# EAGLE design 5-Band 50W PA_LC Lowpass Filters (EAGLE 9.4.2)
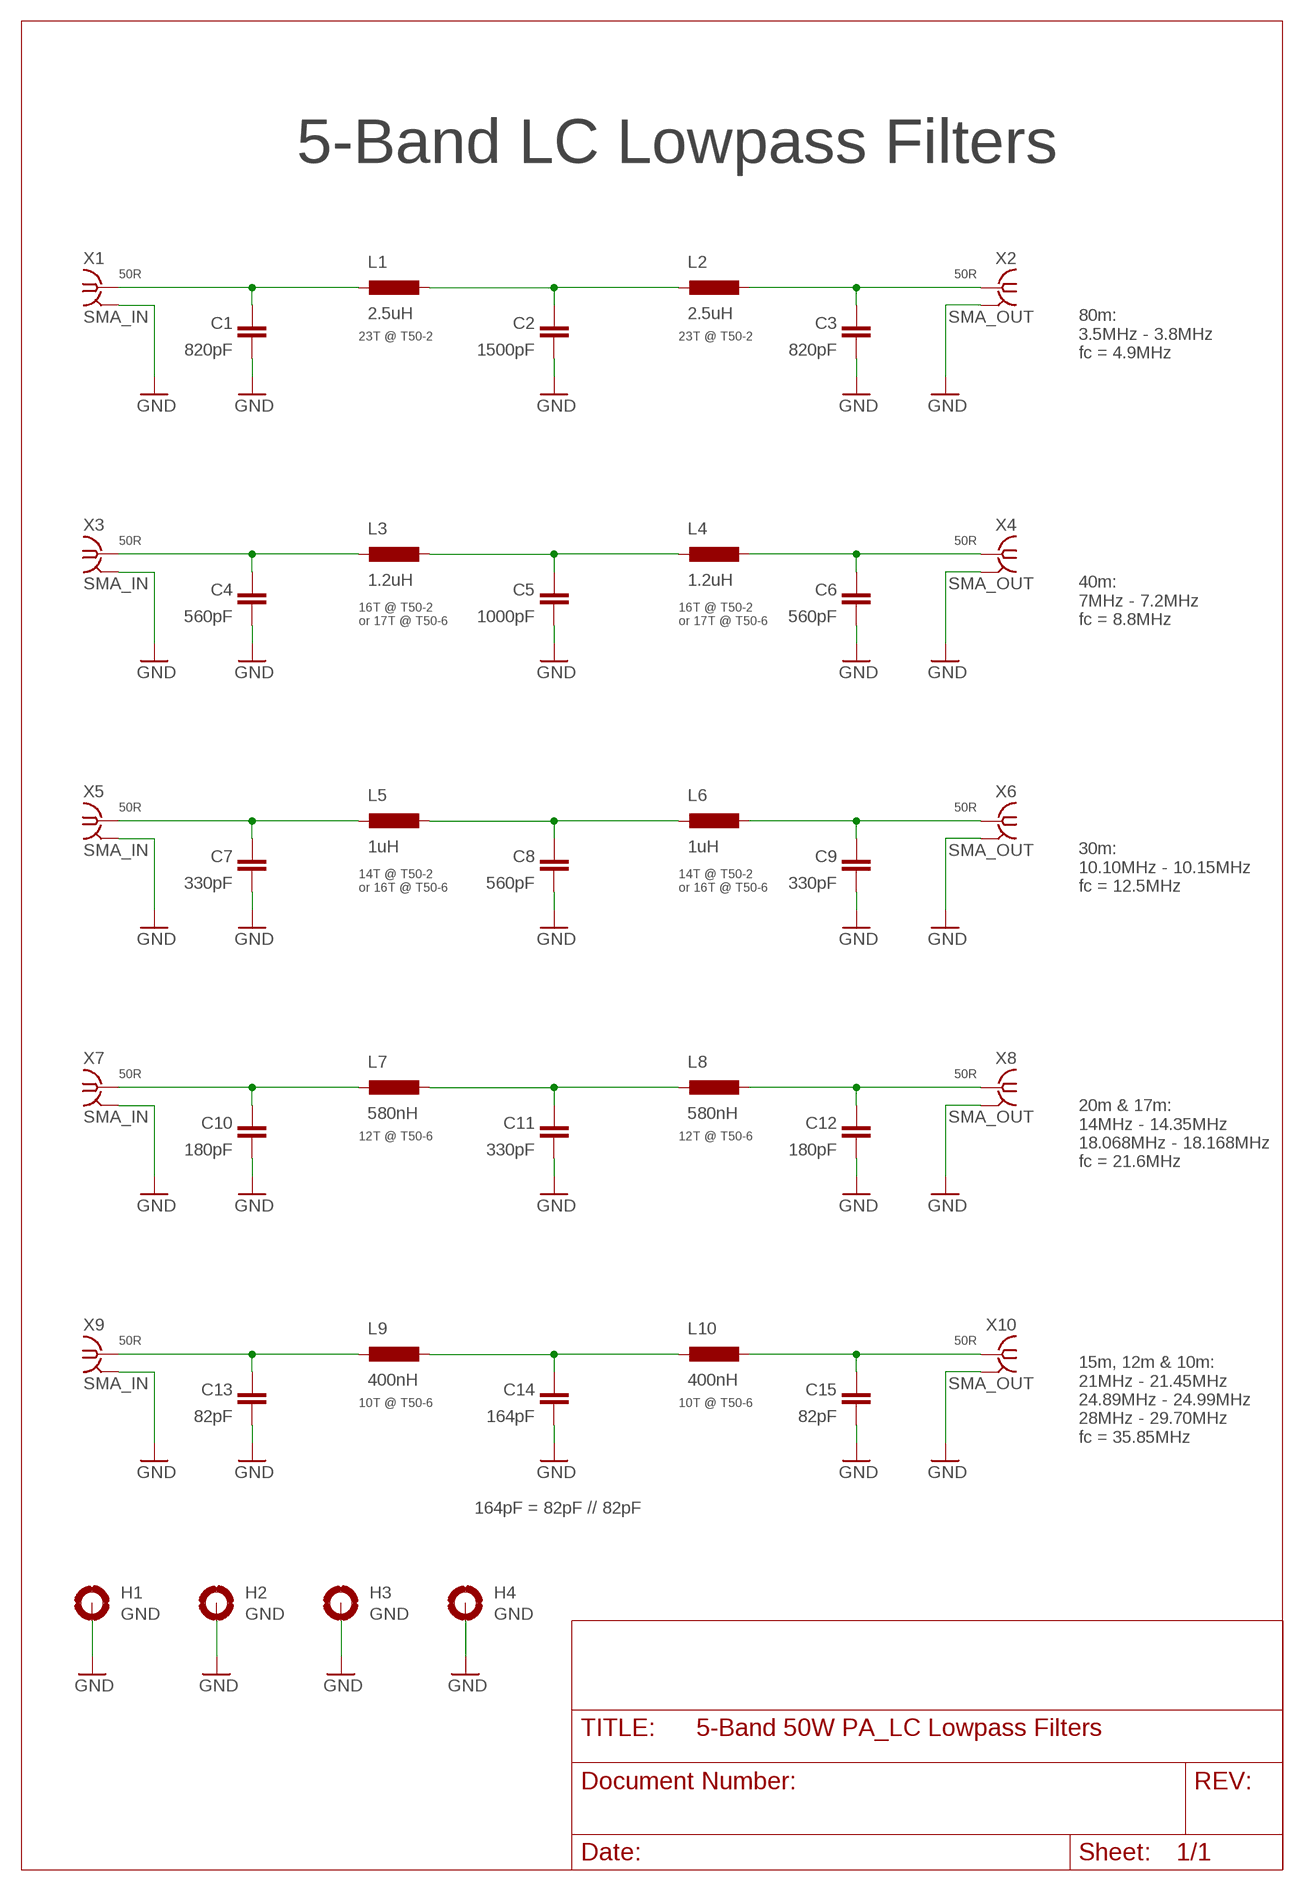
[diagram p0: schematic, sheet 1]

## Parts
C1  820pF  C-EUC1206K  [C1206K]
C2  1500pF  C-EUC1206K  [C1206K]
C3  820pF  C-EUC1206K  [C1206K]
C4  560pF  C-EUC1206K  [C1206K]
C5  1000pF  C-EUC1206K  [C1206K]
C6  560pF  C-EUC1206K  [C1206K]
C7  330pF  C-EUC1206K  [C1206K]
C8  560pF  C-EUC1206K  [C1206K]
C9  330pF  C-EUC1206K  [C1206K]
C10  180pF  C-EUC1206K  [C1206K]
C11  330pF  C-EUC1206K  [C1206K]
C12  180pF  C-EUC1206K  [C1206K]
C13  82pF  C-EUC1206K  [C1206K]
C14  164pF  C-EUC1206K  [C1206K]
C15  82pF  C-EUC1206K  [C1206K]
H1  GND  MOUNT-PAD-ROUND3.0  [3,0-PAD]
H2  GND  MOUNT-PAD-ROUND3.0  [3,0-PAD]
H3  GND  MOUNT-PAD-ROUND3.0  [3,0-PAD]
H4  GND  MOUNT-PAD-ROUND3.0  [3,0-PAD]
L1  2.5uH  T50-6  [T50-6SMD]
L2  2.5uH  T50-6  [T50-6SMD]
L3  1.2uH  T50-6  [T50-6SMD]
L4  1.2uH  T50-6  [T50-6SMD]
L5  1uH  T50-6  [T50-6SMD]
L6  1uH  T50-6  [T50-6SMD]
L7  580nH  T50-6  [T50-6SMD]
L8  580nH  T50-6  [T50-6SMD]
L9  400nH  T50-6  [T50-6SMD]
L10  400nH  T50-6  [T50-6SMD]
X1  SMA_IN  SMA-142-0711-821/826  [J502-ND-142-0711-821/826]
X2  SMA_OUT  SMA-142-0711-821/826  [J502-ND-142-0711-821/826]
X3  SMA_IN  SMA-142-0711-821/826  [J502-ND-142-0711-821/826]
X4  SMA_OUT  SMA-142-0711-821/826  [J502-ND-142-0711-821/826]
X5  SMA_IN  SMA-142-0711-821/826  [J502-ND-142-0711-821/826]
X6  SMA_OUT  SMA-142-0711-821/826  [J502-ND-142-0711-821/826]
X7  SMA_IN  SMA-142-0711-821/826  [J502-ND-142-0711-821/826]
X8  SMA_OUT  SMA-142-0711-821/826  [J502-ND-142-0711-821/826]
X9  SMA_IN  SMA-142-0711-821/826  [J502-ND-142-0711-821/826]
X10  SMA_OUT  SMA-142-0711-821/826  [J502-ND-142-0711-821/826]

## Nets
GND: C1.1 C2.1 C3.1 C4.1 C5.1 C6.1 C7.1 C8.1 C9.1 C10.1 C11.1 C12.1 C13.1 C14.1 C15.1 H1.B3,0(MOUNT) H2.B3,0(MOUNT) H3.B3,0(MOUNT) H4.B3,0(MOUNT) X1.G@1 X1.G@2 X1.G@3 X1.G@4 X2.G@1 X2.G@2 X2.G@3 X2.G@4 X3.G@1 X3.G@2 X3.G@3 X3.G@4 X4.G@1 X4.G@2 X4.G@3 X4.G@4 X5.G@1 X5.G@2 X5.G@3 X5.G@4 X6.G@1 X6.G@2 X6.G@3 X6.G@4 X7.G@1 X7.G@2 X7.G@3 X7.G@4 X8.G@1 X8.G@2 X8.G@3 X8.G@4 X9.G@1 X9.G@2 X9.G@3 X9.G@4 X10.G@1 X10.G@2 X10.G@3 X10.G@4
N$1: C2.2 L1.P$2 L2.P$1
N$2: C4.2 L3.P$1 X3.1
N$3: C3.2 L2.P$2 X2.1
N$4: C1.2 L1.P$1 X1.1
N$5: C6.2 L4.P$2 X4.1
N$6: C5.2 L3.P$2 L4.P$1
N$7: C7.2 L5.P$1 X5.1
N$8: C9.2 L6.P$2 X6.1
N$9: C8.2 L5.P$2 L6.P$1
N$10: C10.2 L7.P$1 X7.1
N$11: C12.2 L8.P$2 X8.1
N$12: C11.2 L7.P$2 L8.P$1
N$13: C13.2 L9.P$1 X9.1
N$14: C15.2 L10.P$2 X10.1
N$15: C14.2 L9.P$2 L10.P$1

## Notes on the sheet
- 5-Band LC Lowpass Filters
- 50R | 50R
- 23T @ T50-2 | 23T @ T50-2
- 80m:
  3.5MHz - 3.8MHz
  fc = 4.9MHz
- 50R | 50R
- 16T @ T50-2 
  or 17T @ T50-6
- 16T @ T50-2 
  or 17T @ T50-6
- 40m:
  7MHz - 7.2MHz
  fc = 8.8MHz
- 50R | 50R
- 14T @ T50-2
  or 16T @ T50-6
- 14T @ T50-2
  or 16T @ T50-6
- 30m:
  10.10MHz - 10.15MHz
  fc = 12.5MHz
- 50R | 50R
- 12T @ T50-6 | 12T @ T50-6
- 20m & 17m:
  14MHz - 14.35MHz
  18.068MHz - 18.168MHz
  fc = 21.6MHz
- 50R | 50R
- 10T @ T50-6 | 10T @ T50-6
- 15m, 12m & 10m:
  21MHz - 21.45MHz
  24.89MHz - 24.99MHz
  28MHz - 29.70MHz
  fc = 35.85MHz
- 164pF = 82pF // 82pF

## Library data of the parts
C1-C15 = rcl:C-EU: CAPACITOR, European symbol; SPICEPREFIX: C
H1-H4 = holes:MOUNT-PAD-ROUND: MOUNTING PAD, round
L1-L10 = Ham Radio:T50-6
X1-X10 = con-coax:SMA-: SMA 50 Ohm End Launch Jack Receptacle - Round Contact Johnson Components Source: www.johnsoncomponents.com .. J502-ND.pdf; MF: JOHNSON COMPONENTS; MPN: 142-0711-821; OC_FARNELL: 1019328; OC_NEWARK: 16F3627

## Board
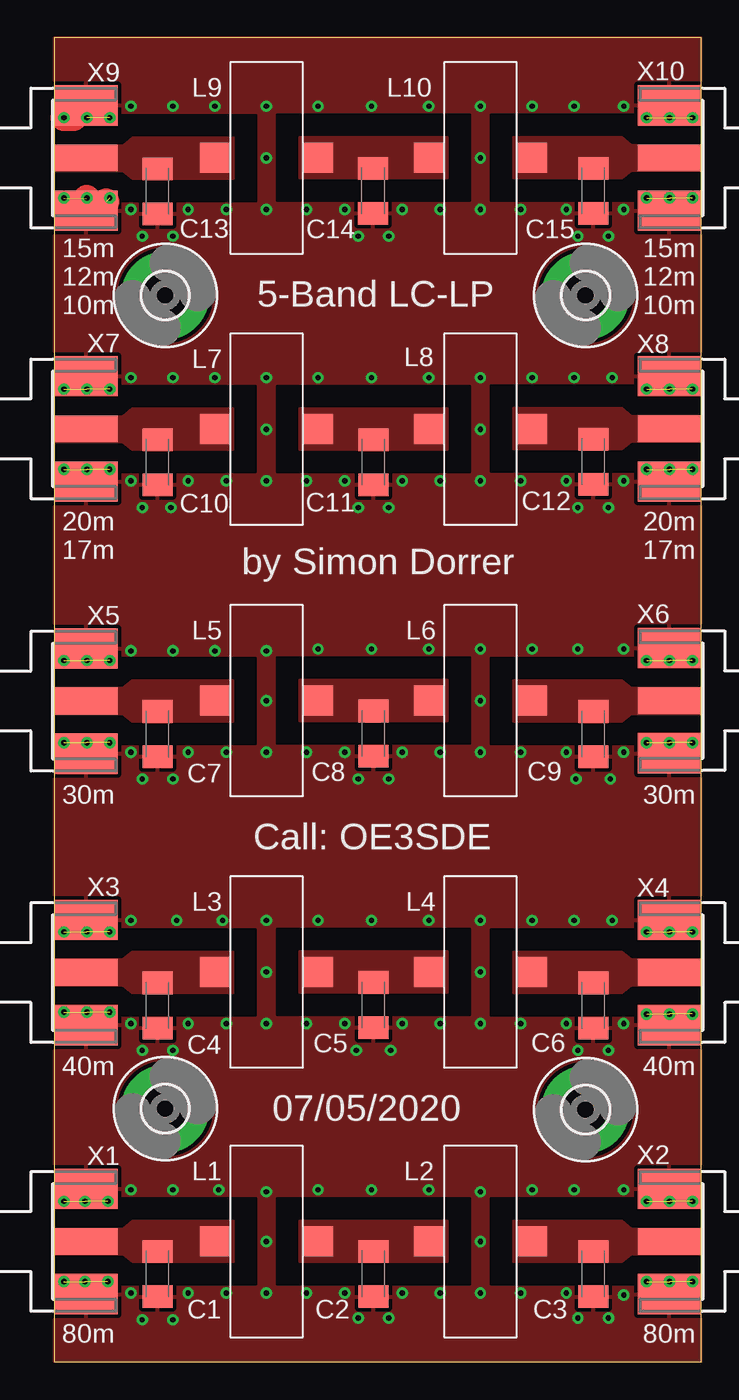
[diagram p1: board, top side]
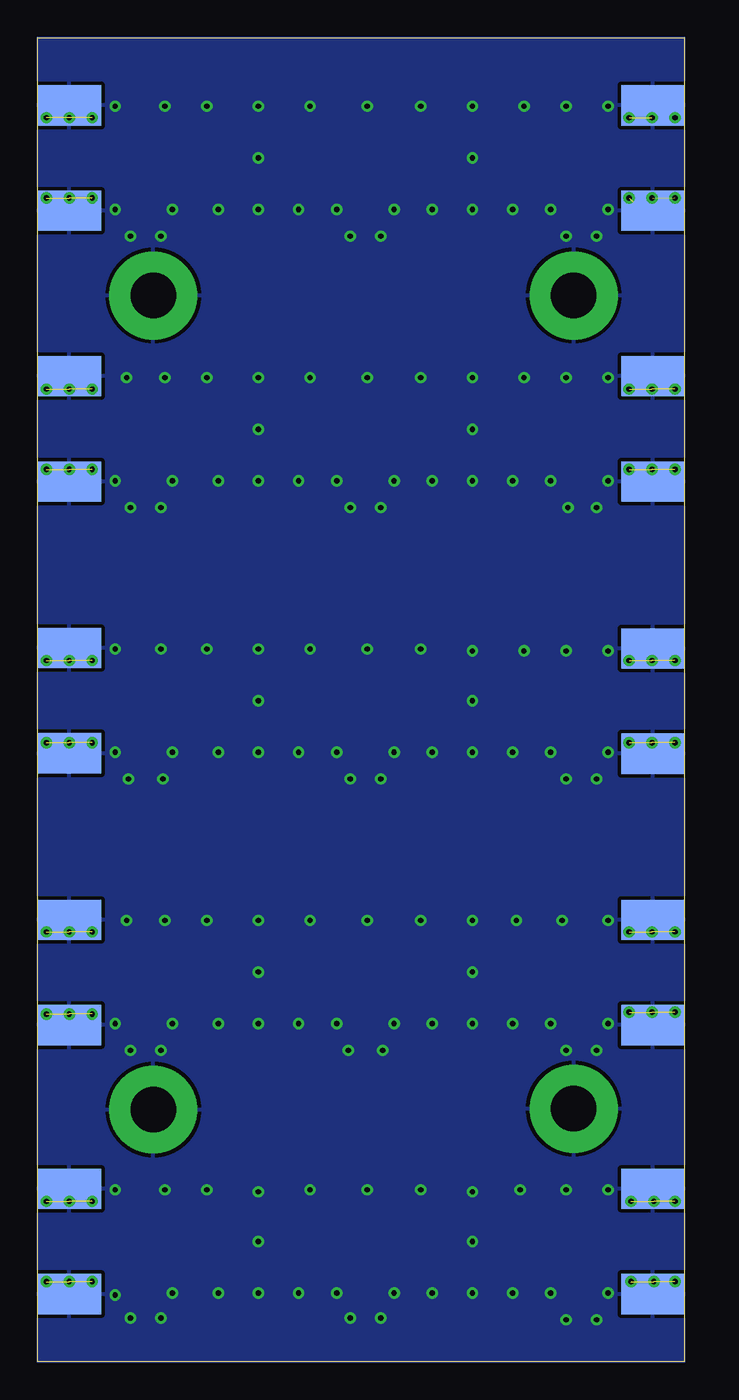
[diagram p2: board, bottom side, seen from below]

Size 43 x 88 mm. Coordinates in mm from the lower left corner, seen from the top.
Outline: 0,0 43,0 43,88 0,88 0,0
Copper layers (1*16): Top 0.035mm / dielectric 1.5mm / Bottom 0.035mm
Design rules "default *": minimum track width 6mil, minimum drill 0.35mm, track to track 6mil, track to pad 6mil, pad to pad 6mil, via to via 6mil, smd to smd 6mil, copper to edge 0mil, drill to drill 6mil, minimum pad ring 10mil, minimum via ring 8mil, stop-mask expansion 4mil, vias tented up to drill 0mil, thermal gap 10mil

### Footprints (pad centres in the part's own frame; a part is rotated, then mirrored left to right if it is on the bottom)
C1206K = smd 1.5 x 2: 1 -1.5,0; 2 1.5,0
3,0-PAD = drill 3 pad 5.842: B3,0 0,0
T50-6SMD = smd 2 x 2: P$1 -3.54,0; P$2 3.29,0
J502-ND-142-0711-821/826 = smd 4.191 x 1.778: 1 2.115,0 | smd 4.191 x 2.667: G@1 2.115,3.495; G@2 2.115,-3.495 | smd 4.191 x 2.667 bottom: G@3 2.115,3.495; G@4 2.115,-3.495

### Placement (x,y rotation side)
C1  6.86,5.84 90 top
C2  21.21,5.84 90 top
C3  35.81,5.84 90 top
C4  6.86,23.69 90 top
C5  21.21,23.72 90 top
C6  35.81,23.69 90 top
C7  6.86,41.72 90 top
C8  21.21,41.75 90 top
C9  35.81,41.72 90 top
C10  6.86,59.79 90 top
C11  21.21,59.79 90 top
C12  35.81,59.82 90 top
C13  6.86,77.79 90 top
C14  21.18,77.82 90 top
C15  35.81,77.82 90 top
H1  7.37,16.83 0 top
H2  35.31,16.76 0 top
H3  35.31,70.87 0 top
H4  7.37,70.87 0 top
L1  14.22,8 0 top
L2  28.45,8 0 top
L3  14.22,25.91 0 top
L4  28.45,25.91 0 top
L5  14.22,43.94 0 top
L6  28.45,43.94 0 top
L7  14.22,61.98 0 top
L8  28.45,61.98 0 top
L9  14.22,80.01 0 top
L10  28.45,80.01 0 top
X1  0,8 0 top
X2  43,8 180 top
X3  0,25.87 0 top
X4  43,25.87 180 top
X5  0,43.91 0 top
X6  43,43.94 180 top
X7  0,62 0 top
X8  43,62 180 top
X9  0,80 0 top
X10  43,80 180 top

### Tracks (layer width: path | path; a pad name or v marks a point on that pad's centre or on a via)
GND  (via drill 0.35)  (39 unrouted)
  Top 1.75: X9.G@3 1.3,82.68 v0.64,82.68 | 2.12,77.3 v2.16,77.34 | X9.G@4 2.85,76.5 3.43,77.09
  other vias: 5.08,11.43 7.87,11.43 28.32,8 14.1,8 14.1,4.57 14.1,11.3 8.89,4.57 5.08,4.57 0.64,5.33 2.03,5.33 3.56,5.33 0.64,10.67 2.03,10.67 3.56,10.67 10.92,11.43 5.84,2.79 17.53,11.43 19.3,4.57 21.08,11.43 24.89,11.43 28.32,4.57 28.32,11.3 23.11,4.57 20.19,2.92 34.8,2.92 30.99,4.57 34.04,4.57 37.85,4.45 39.37,5.33 40.89,5.33 42.42,5.33 42.42,10.67 40.89,10.67 39.37,10.67 31.75,11.43 37.85,11.43 34.54,11.43 0.64,23.24 2.16,23.24 3.68,23.24 0.64,28.57 2.16,28.57 3.68,28.57 0.64,41.15 2.16,41.15 3.68,41.15 0.64,46.61 2.16,46.61 3.68,46.61 0.64,59.31 2.16,59.31 3.68,59.31 0.64,64.64 2.16,64.64 3.68,64.64 0.64,77.34 3.68,77.34 2.16,82.68 3.68,82.68 5.08,83.44 7.87,83.44 14.1,83.44 10.67,83.44 17.53,83.44 21.08,83.44 24.89,83.44 28.32,83.44 31.75,83.44 37.85,83.44 34.54,83.44 5.08,65.41 7.87,65.41 14.1,65.41 10.67,65.41 17.53,65.41 21.08,65.41 24.89,65.41 28.32,65.41 31.75,65.41 37.08,65.41 34.54,65.41 5.08,47.24 7.87,47.24 14.1,47.24 10.67,47.24 17.53,47.37 21.08,47.37 24.89,47.37 28.32,47.37 31.75,47.37 37.85,47.37 34.8,47.37 5.08,29.34 8.13,29.34 14.1,29.34 11.18,29.34 17.53,29.34 21.08,29.34 24.89,29.34 28.32,29.34 31.75,29.34 37.08,29.34 34.54,29.34 14.1,22.48 8.89,22.48 5.08,22.48 11.43,22.48 5.84,20.7 16.76,22.48 28.32,22.48 25.65,22.48 20.07,20.7 34.8,20.7 30.99,22.48 34.04,22.48 37.85,22.48 14.1,76.58 8.89,76.58 5.08,76.58 11.43,76.58 5.84,74.8 16.76,76.58 28.32,76.58 23.11,76.58 20.19,74.8 34.8,74.8 30.99,76.58 34.04,76.58 37.85,76.58 14.1,58.55 8.89,58.55 5.08,58.55 11.43,58.55 5.84,56.77 16.76,58.55 28.32,58.55 23.11,58.55 20.19,56.77 34.8,56.77 30.99,58.55 34.04,58.55 37.85,58.55 14.1,40.51 8.89,40.51 5.08,40.51 11.43,40.51 5.84,38.73 16.76,40.51 28.32,40.51 25.65,40.51 20.19,38.73 34.67,38.73 30.99,40.51 34.04,40.51 37.85,40.51 39.37,82.68 40.89,82.68 42.42,82.68 39.37,77.34 40.89,77.34 42.42,77.34 39.37,64.64 40.89,64.64 42.42,64.64 39.37,59.31 40.89,59.31 42.42,59.31 39.37,46.61 40.89,46.61 42.42,46.61 39.37,41.15 40.89,41.15 42.42,41.15 39.37,28.57 40.89,28.57 42.42,28.57 39.37,23.11 40.89,23.11 42.42,23.11 14.1,25.91 14.1,43.94 14.1,61.98 14.1,80.01 28.32,80.01 28.32,61.98 28.32,43.94 28.32,25.91 7.87,2.79 22.23,2.92 36.83,2.92 22.35,20.7 7.87,20.7 36.83,20.7 7.87,38.73 36.96,38.73 22.23,38.73 7.87,74.8 22.23,74.8 36.83,74.8 11.43,4.57 36.83,56.77 22.23,56.77 7.75,56.77 19.3,76.58 25.65,76.58 19.3,58.55 25.65,58.55 19.3,40.51 23.11,40.51 19.3,22.48 23.11,22.48 16.76,4.57 25.65,4.57
  pour Top (isolate 1.5, rank 2): 0,0 0,88 43,88 43,0
  pour Bottom (isolate 1.5): 0,0 0,88 43,88 43,0
N$1
  pour Top (no thermals): 16.26,9.4 16.26,6.6 26.16,6.6 26.16,9.4
N$2
  pour Top (no thermals): 5.18,27.27 11.91,27.27 11.91,24.48 5.18,24.48 4.54,24.99 -0.03,24.99 -0.03,26.77 4.54,26.77
N$3
  pour Top (no thermals): 37.72,6.6 30.48,6.6 30.48,9.4 37.72,9.4 38.35,8.89 43.05,8.89 43.05,7.11 38.35,7.11
N$4
  pour Top (no thermals): 5.21,9.4 11.94,9.4 11.94,6.6 5.21,6.6 4.57,7.11 0,7.11 0,8.89 4.57,8.89
N$5
  pour Top (no thermals): 37.72,24.48 30.48,24.48 30.48,27.27 37.72,27.27 38.35,26.77 43.05,26.77 43.05,24.99 38.35,24.99
N$6
  pour Top (no thermals): 16.26,27.3 16.26,24.51 26.16,24.51 26.16,27.3
N$7
  pour Top (no thermals): 5.18,45.31 11.91,45.31 11.91,42.51 5.18,42.51 4.54,43.02 -0.03,43.02 -0.03,44.8 4.54,44.8
N$8
  pour Top (no thermals): 37.72,42.51 30.48,42.51 30.48,45.31 37.72,45.31 38.35,44.8 43.05,44.8 43.05,43.02 38.35,43.02
N$9
  pour Top (no thermals): 16.26,45.34 16.26,42.55 26.16,42.55 26.16,45.34
N$10
  pour Top (no thermals): 5.18,63.37 11.91,63.37 11.91,60.58 5.18,60.58 4.54,61.09 -0.03,61.09 -0.03,62.87 4.54,62.87
N$11
  pour Top (no thermals): 37.72,60.61 30.48,60.61 30.48,63.4 37.72,63.4 38.35,62.9 43.05,62.9 43.05,61.12 38.35,61.12
N$12
  pour Top (no thermals): 16.26,63.37 16.26,60.58 26.16,60.58 26.16,63.37
N$13
  pour Top (no thermals): 5.21,81.38 11.94,81.38 11.94,78.58 5.21,78.58 4.57,79.09 0,79.09 0,80.87 4.57,80.87
N$14
  pour Top (no thermals): 37.72,78.61 30.48,78.61 30.48,81.41 37.72,81.41 38.35,80.9 43.05,80.9 43.05,79.12 38.35,79.12
N$15
  pour Top (no thermals): 16.26,81.41 16.26,78.61 26.16,78.61 26.16,81.41

### Text on the board
tNames: 15m / 12m / 10m | 5-Band LC-LP | 15m / 12m / 10m | 20m / 17m | 20m / 17m | by Simon Dorrer | 30m | 30m | Call: OE3SDE | 40m | 40m | 07/05/2020 | 80m | 80m